# Altium schematic sheet POWER.SchDoc
size A4
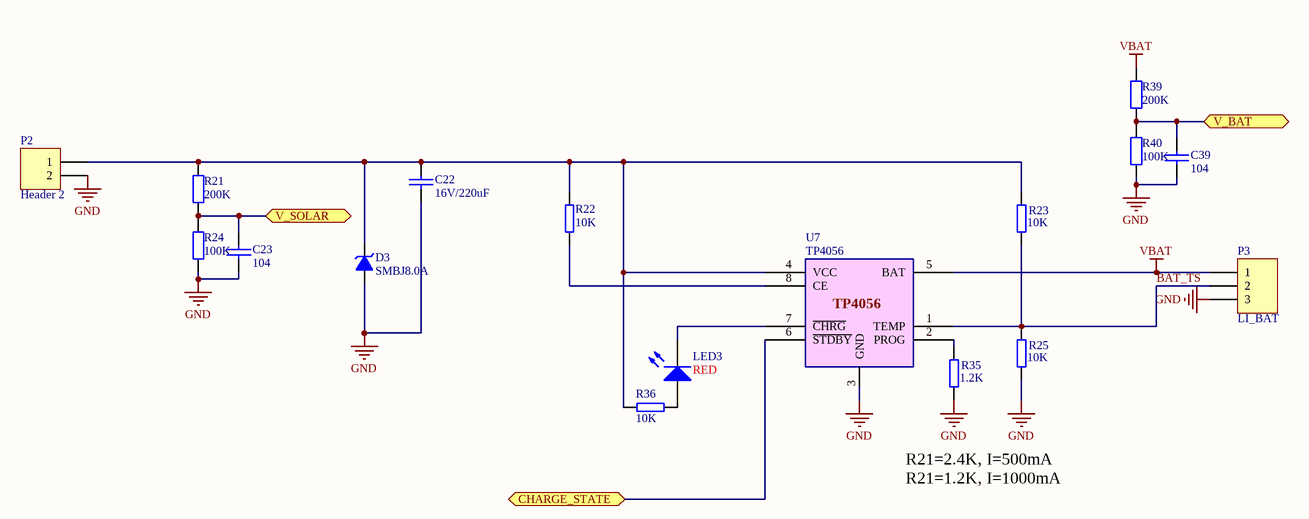
[diagram p0: POWER.SchDoc]

## Parts
C22  16V/220uF  [CAP1210]
C23  104  [0603C]
C39  104  [0603C]
D3  SMBJ8.0A  [DO-214AA]
LED3  RED  [LED-0603]
P2  Header 2  [HEADER_2WAY_2.54MM]
P3  LI_BAT  [HDR1X3_1.25mm]
R21  200K  [0603R]
R22  10K  [0603R]
R23  10K  [0603R]
R24  100K  [0603R]
R25  10K  [0603R]
R35  1.2K  [0603R]
R36  10K  [0603R]
R39  200K  [0603R]
R40  100K  [0603R]
U7  TP4056  [TP4056]

## Ports
CHARGE_STATE, V_BAT, V_SOLAR

## Nets
GND: C22.2 C23.1 C39.1 D3.1(A) P2.2 P3.3 R24.2 R25.2 R35.2 R40.2 U7.3(GND)
VBAT: P3.1 R39.1 U7.5(BAT)
BAT_TS: P3.2 R23.2 R25.1 U7.1(TEMP)
CHARGE_STATE: U7.6(~{STDBY}) ; port CHARGE_STATE
V_BAT: C39.2 R39.2 R40.1 ; port V_BAT
V_SOLAR: C23.2 R21.2 R24.1 ; port V_SOLAR
NetC22_1: C22.1 D3.2(K) P2.1 R21.1 R22.2 R23.1 R36.1 U7.4(VCC)
NetLED3_1: LED3.1(A) R36.2
NetLED3_2: LED3.2(K) U7.7(~{CHRG})
NetR22_1: R22.1 U7.8(CE)
NetR35_1: R35.1 U7.2(PROG)

## Notes on the sheet
- R21=2.4K, I=500mA
  R21=1.2K, I=1000mA

## Library data of the parts
C22 C23 C39 = 0603C
D3 = D Zener: Zener Diode; Published: 8-Jun-2000; LatestRevisionDate: 17-Jul-2002; LatestRevisionNote: Re-released for DXP Platform.; Publisher: Altium Limited
LED3 = LED3: RED LED; Published: 8-Jun-2000; LatestRevisionDate: 17-Dec-2003; LatestRevisionNote: PCB Footprint replaced.; DatasheetDocument: 16-Apr-2002; PackageDocument: 16-Apr-2002; PackageReference: 3.5X2.8X1.9; Publisher: Altium Limited
P2 = Header 2: Header, 2-Pin; LatestRevisionDate: 17-Jul-2002; LatestRevisionNote: Re-released for DXP Platform.; Publisher: Altium Limited
P3 = Header 3: Header, 3-Pin; LatestRevisionDate: 17-Jul-2002; LatestRevisionNote: Re-released for DXP Platform.; Publisher: Altium Limited
R21 R24 R39 R40 = 0603R
R22 R23 R25 R35 R36 = RES2A